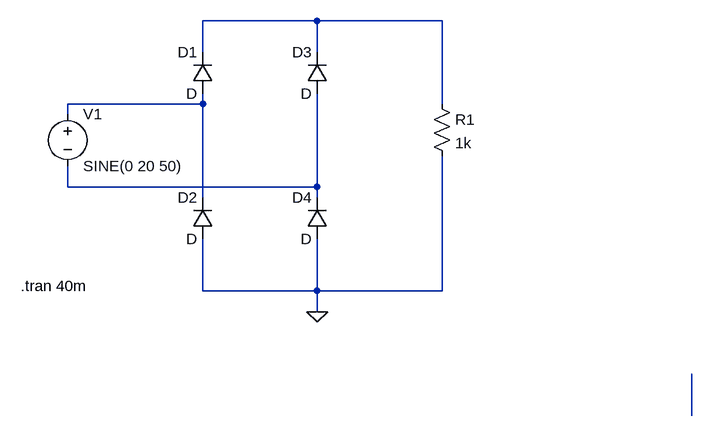
[diagram p0: schematic FullWaveRectifier.asc]
FullWaveRectifier.asc, the LTspice schematic file:
Version 4
SHEET 1 880 680
WIRE 192 -16 16 -16
WIRE 384 -16 192 -16
WIRE 16 32 16 -16
WIRE 192 32 192 -16
WIRE 16 112 16 96
WIRE 16 112 -192 112
WIRE 384 112 384 -16
WIRE -192 128 -192 112
WIRE -192 240 -192 208
WIRE 192 240 192 96
WIRE 192 240 -192 240
WIRE 16 256 16 112
WIRE 192 256 192 240
WIRE 16 400 16 320
WIRE 192 400 192 320
WIRE 192 400 16 400
WIRE 384 400 384 192
WIRE 384 400 192 400
WIRE 192 432 192 400
WIRE 768 592 768 528
FLAG 192 432 0
SYMBOL voltage -192 112 R0
SYMATTR InstName V1
SYMATTR Value SINE(0 20 50)
SYMBOL diode 32 96 R180
WINDOW 0 24 64 Left 2
WINDOW 3 24 0 Left 2
SYMATTR InstName D1
SYMBOL diode 32 320 R180
WINDOW 0 24 64 Left 2
WINDOW 3 24 0 Left 2
SYMATTR InstName D2
SYMBOL diode 208 96 R180
WINDOW 0 24 64 Left 2
WINDOW 3 24 0 Left 2
SYMATTR InstName D3
SYMBOL diode 208 320 R180
WINDOW 0 24 64 Left 2
WINDOW 3 24 0 Left 2
SYMATTR InstName D4
SYMBOL res 368 96 R0
SYMATTR InstName R1
SYMATTR Value 1k
TEXT -264 392 Left 2 !.tran 40m

The netlist it stands for:
* FullWaveRectifier.asc
V1 N002 N003 SINE(0 20 50)
D1 N002 N001 D
D2 0 N002 D
D3 N003 N001 D
D4 0 N003 D
R1 N001 0 1k
.model D D
.lib standard.dio
.tran 40m
.backanno
.end